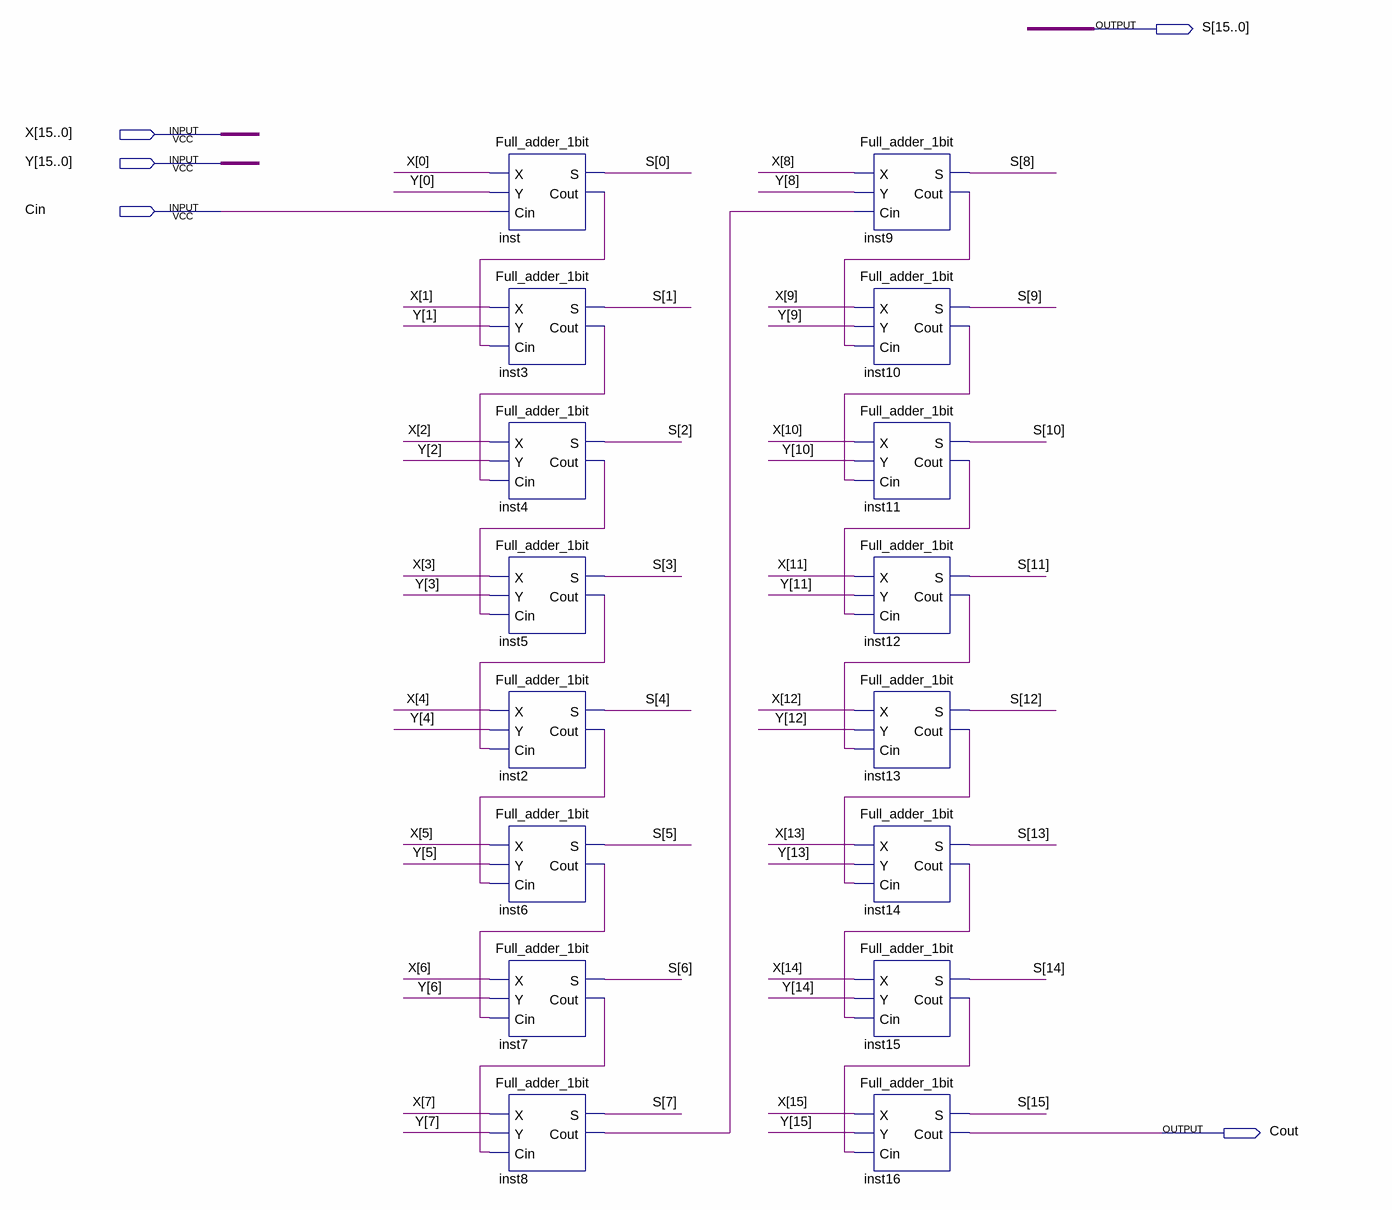
[diagram p0: schematic sheet]
// Quartus schematic Full_adder_16bit.bdf as structural Verilog: 16 symbols, 5 pins
module Full_adder_16bit (
  input  [15:0] X,
  input  [15:0] Y,
  input  Cin,
  output [15:0] S,
  output Cout
);

  wire inst2_cout, inst3_cout, inst4_cout, inst5_cout, inst6_cout, inst7_cout, inst8_cout, inst9_cout,
       inst10_cout, inst11_cout, inst12_cout, inst13_cout, inst14_cout, inst15_cout, inst_cout;

  Full_adder_1bit inst (.X(X[0]), .Y(Y[0]), .Cin(Cin), .S(S[0]), .Cout(inst_cout));
  Full_adder_1bit inst3 (.X(X[1]), .Y(Y[1]), .Cin(inst_cout), .S(S[1]), .Cout(inst3_cout));
  Full_adder_1bit inst4 (.X(X[2]), .Y(Y[2]), .Cin(inst3_cout), .S(S[2]), .Cout(inst4_cout));
  Full_adder_1bit inst5 (.X(X[3]), .Y(Y[3]), .Cin(inst4_cout), .S(S[3]), .Cout(inst5_cout));
  Full_adder_1bit inst2 (.X(X[4]), .Y(Y[4]), .Cin(inst5_cout), .S(S[4]), .Cout(inst2_cout));
  Full_adder_1bit inst6 (.X(X[5]), .Y(Y[5]), .Cin(inst2_cout), .S(S[5]), .Cout(inst6_cout));
  Full_adder_1bit inst7 (.X(X[6]), .Y(Y[6]), .Cin(inst6_cout), .S(S[6]), .Cout(inst7_cout));
  Full_adder_1bit inst8 (.X(X[7]), .Y(Y[7]), .Cin(inst7_cout), .S(S[7]), .Cout(inst8_cout));
  Full_adder_1bit inst9 (.X(X[8]), .Y(Y[8]), .Cin(inst8_cout), .S(S[8]), .Cout(inst9_cout));
  Full_adder_1bit inst10 (.X(X[9]), .Y(Y[9]), .Cin(inst9_cout), .S(S[9]), .Cout(inst10_cout));
  Full_adder_1bit inst11 (.X(X[10]), .Y(Y[10]), .Cin(inst10_cout), .S(S[10]), .Cout(inst11_cout));
  Full_adder_1bit inst12 (.X(X[11]), .Y(Y[11]), .Cin(inst11_cout), .S(S[11]), .Cout(inst12_cout));
  Full_adder_1bit inst13 (.X(X[12]), .Y(Y[12]), .Cin(inst12_cout), .S(S[12]), .Cout(inst13_cout));
  Full_adder_1bit inst14 (.X(X[13]), .Y(Y[13]), .Cin(inst13_cout), .S(S[13]), .Cout(inst14_cout));
  Full_adder_1bit inst15 (.X(X[14]), .Y(Y[14]), .Cin(inst14_cout), .S(S[14]), .Cout(inst15_cout));
  Full_adder_1bit inst16 (.X(X[15]), .Y(Y[15]), .Cin(inst15_cout), .S(S[15]), .Cout(Cout));
endmodule
